# EAGLE design V9 (EAGLE 9.6.2)
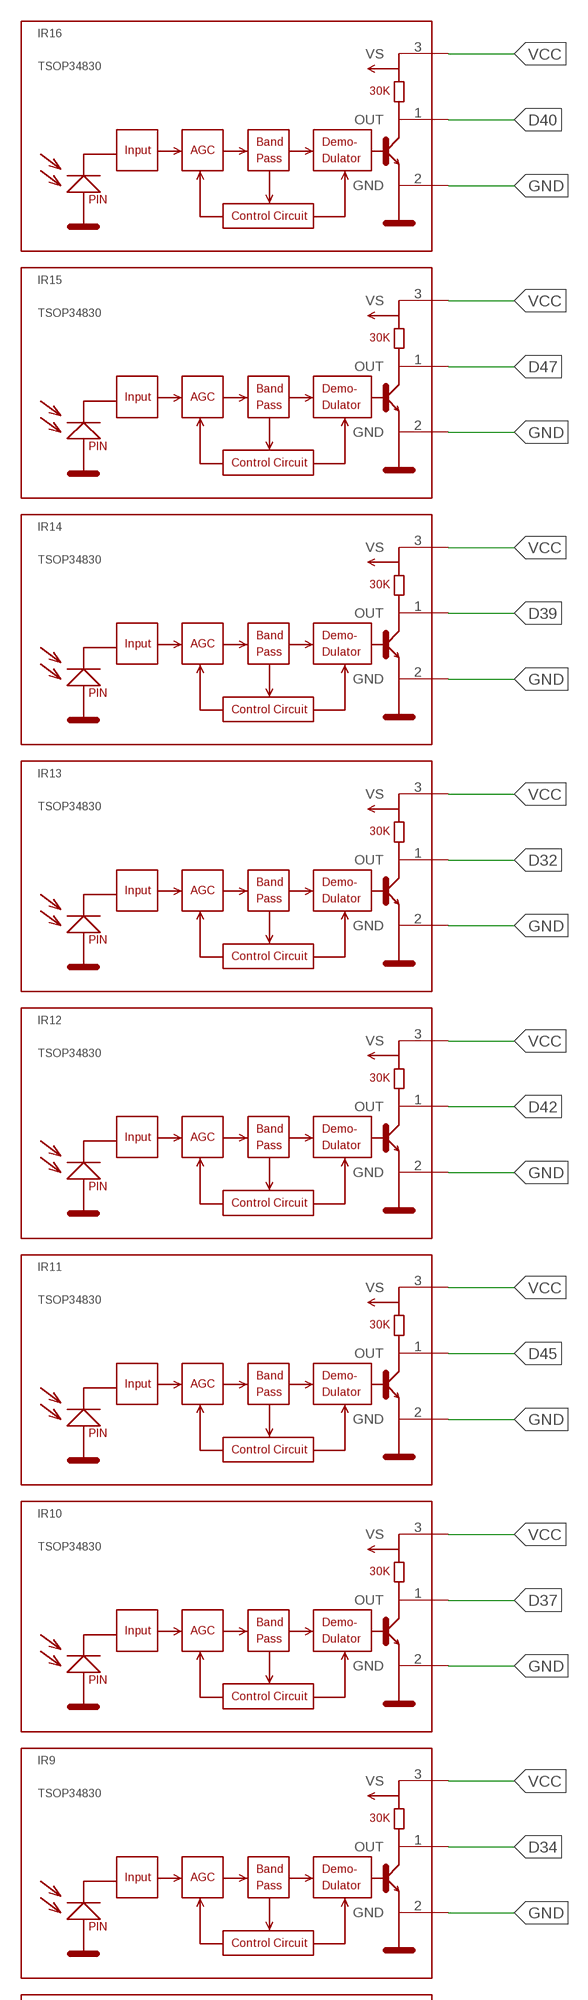
[diagram p0: schematic, sheet 1, part 1 of 2]
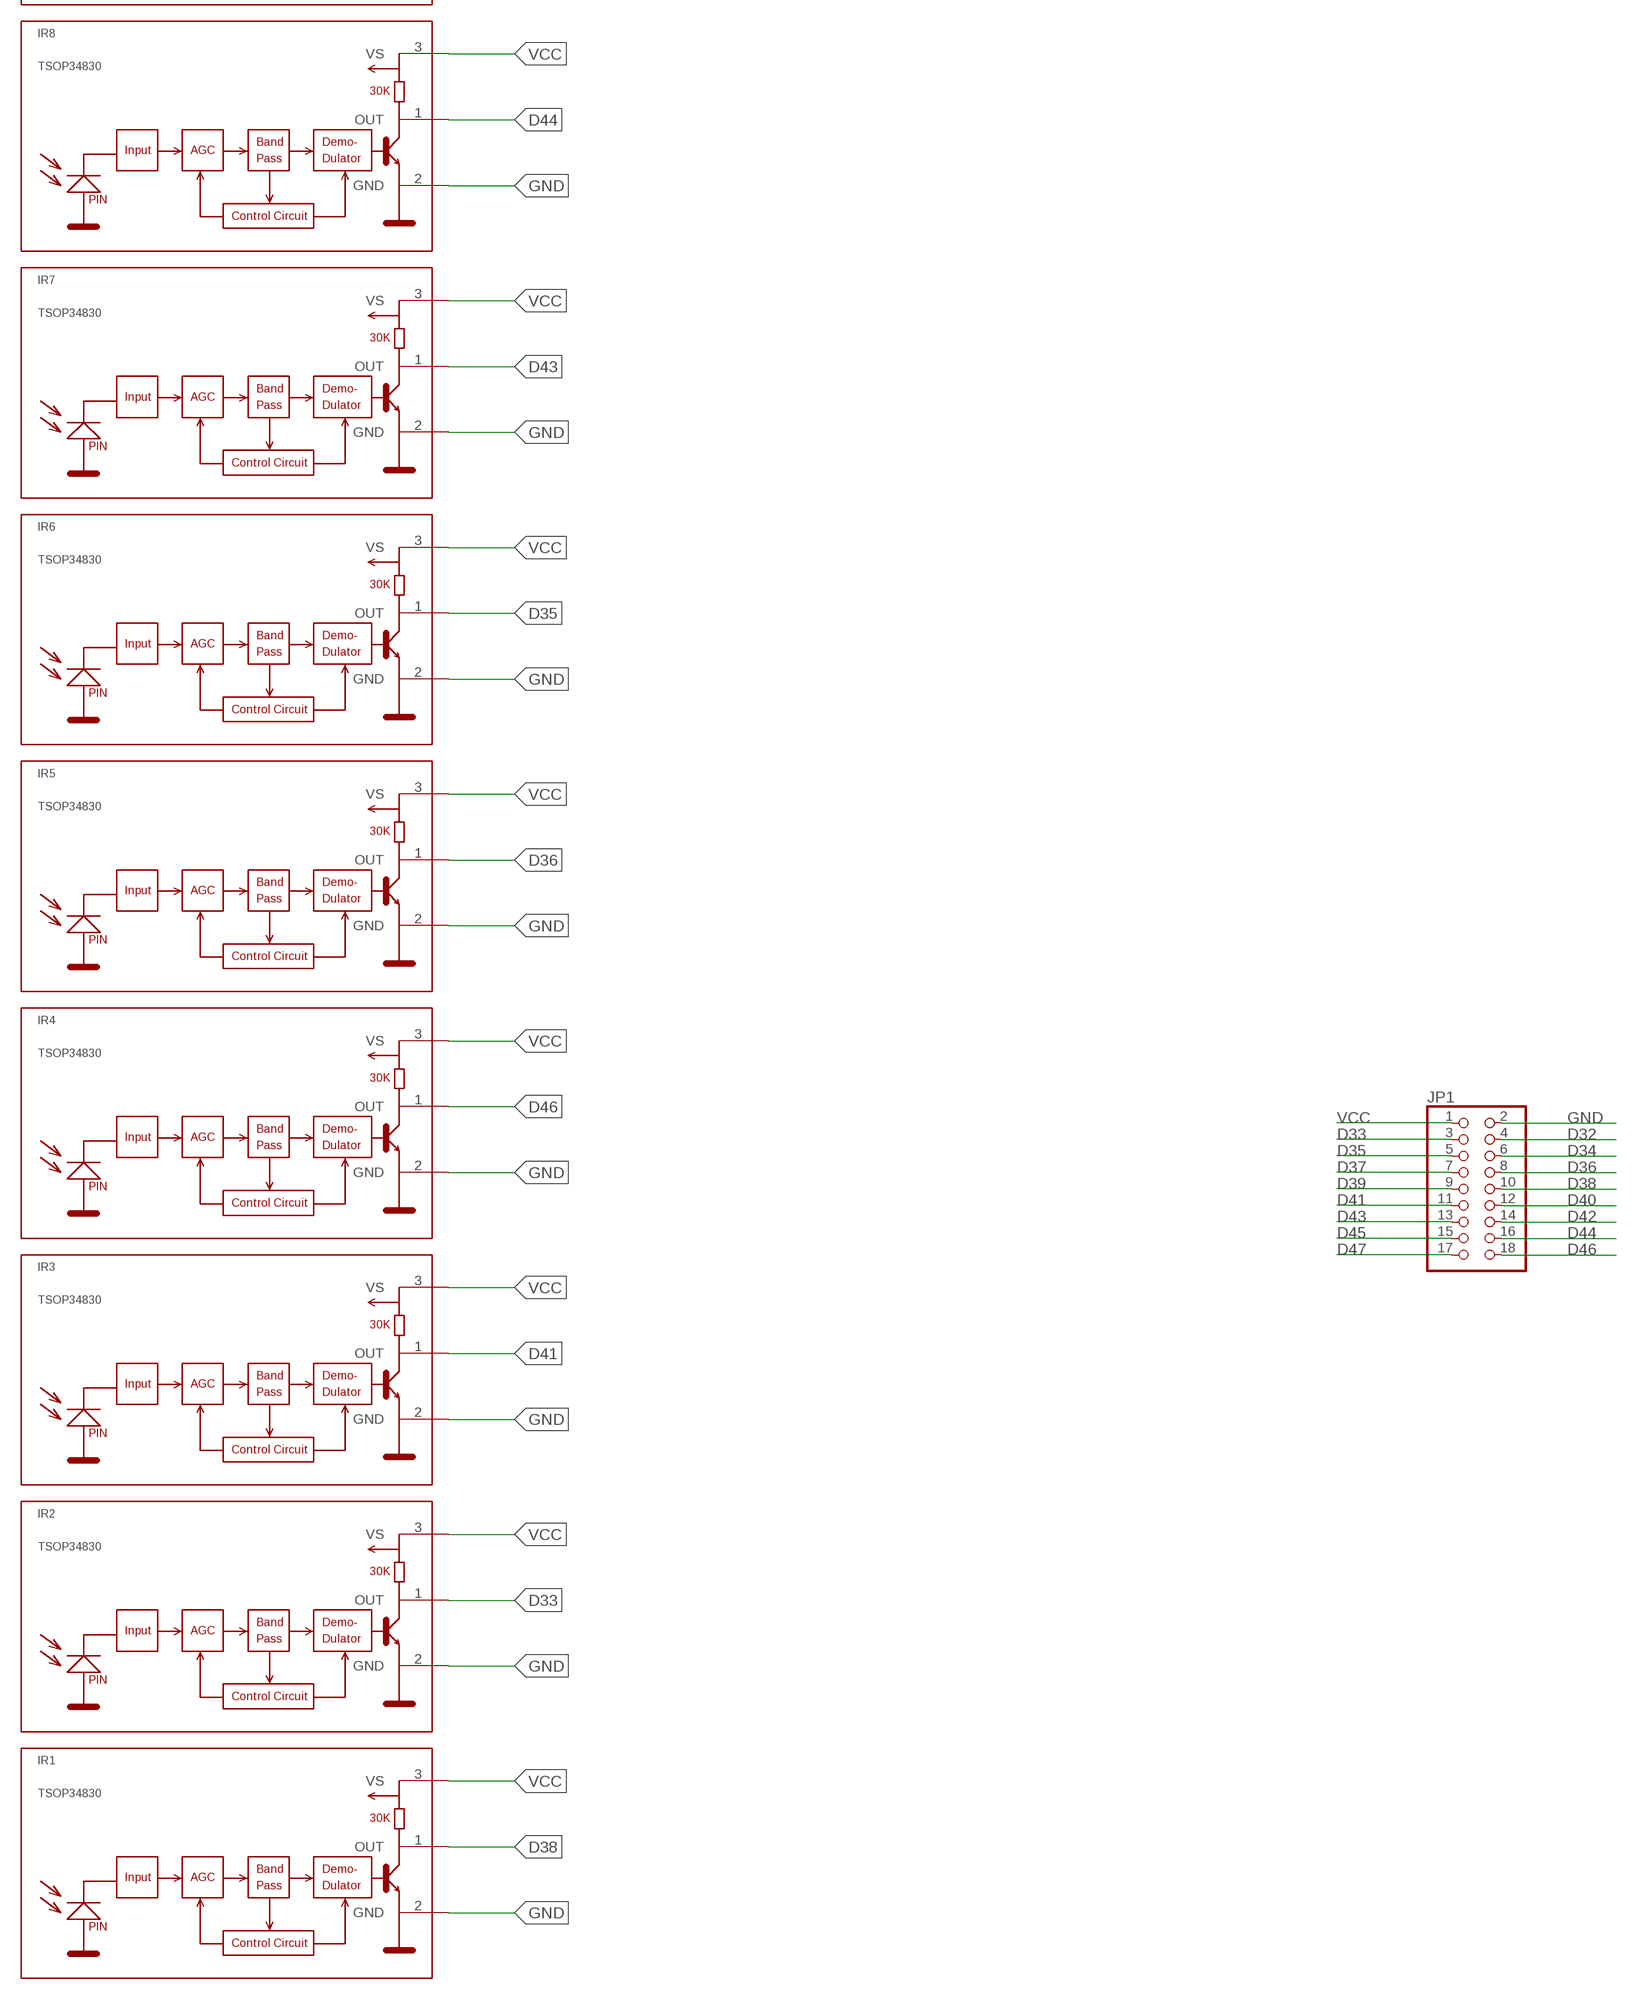
[diagram p1: schematic, sheet 1, part 2 of 2]

## Parts
IR1  TSOP34830  [TSOP348]
IR2  TSOP34830  [TSOP348]
IR3  TSOP34830  [TSOP348]
IR4  TSOP34830  [TSOP348]
IR5  TSOP34830  [TSOP348]
IR6  TSOP34830  [TSOP348]
IR7  TSOP34830  [TSOP348]
IR8  TSOP34830  [TSOP348]
IR9  TSOP34830  [TSOP348]
IR10  TSOP34830  [TSOP348]
IR11  TSOP34830  [TSOP348]
IR12  TSOP34830  [TSOP348]
IR13  TSOP34830  [TSOP348]
IR14  TSOP34830  [TSOP348]
IR15  TSOP34830  [TSOP348]
IR16  TSOP34830  [TSOP348]
JP1  PINHD-2X09_2.54  [2X09]

## Nets
D32: IR13.1(OUT) JP1.4
D33: IR2.1(OUT) JP1.3
D34: IR9.1(OUT) JP1.6
D35: IR6.1(OUT) JP1.5
D36: IR5.1(OUT) JP1.8
D37: IR10.1(OUT) JP1.7
D38: IR1.1(OUT) JP1.10
D39: IR14.1(OUT) JP1.9
D40: IR16.1(OUT) JP1.12
D41: IR3.1(OUT) JP1.11
D42: IR12.1(OUT) JP1.14
D43: IR7.1(OUT) JP1.13
D44: IR8.1(OUT) JP1.16
D45: IR11.1(OUT) JP1.15
D46: IR4.1(OUT) JP1.18
D47: IR15.1(OUT) JP1.17
GND: IR1.2(GND) IR2.2(GND) IR3.2(GND) IR4.2(GND) IR5.2(GND) IR6.2(GND) IR7.2(GND) IR8.2(GND) IR9.2(GND) IR10.2(GND) IR11.2(GND) IR12.2(GND) IR13.2(GND) IR14.2(GND) IR15.2(GND) IR16.2(GND) JP1.2
VCC: IR1.3(VS) IR2.3(VS) IR3.3(VS) IR4.3(VS) IR5.3(VS) IR6.3(VS) IR7.3(VS) IR8.3(VS) IR9.3(VS) IR10.3(VS) IR11.3(VS) IR12.3(VS) IR13.3(VS) IR14.3(VS) IR15.3(VS) IR16.3(VS) JP1.1

## Library data of the parts
IR1-IR16 = vishay-1:TSOP348*: IR Receiver Modules for Remote Control Systems http://www.vishay.com/ir-receiver-modules/
JP1 = pinhead-2:PINHD-2X09: PIN HEADER

## Net classes
0 default: clearance 1 mm

## Board
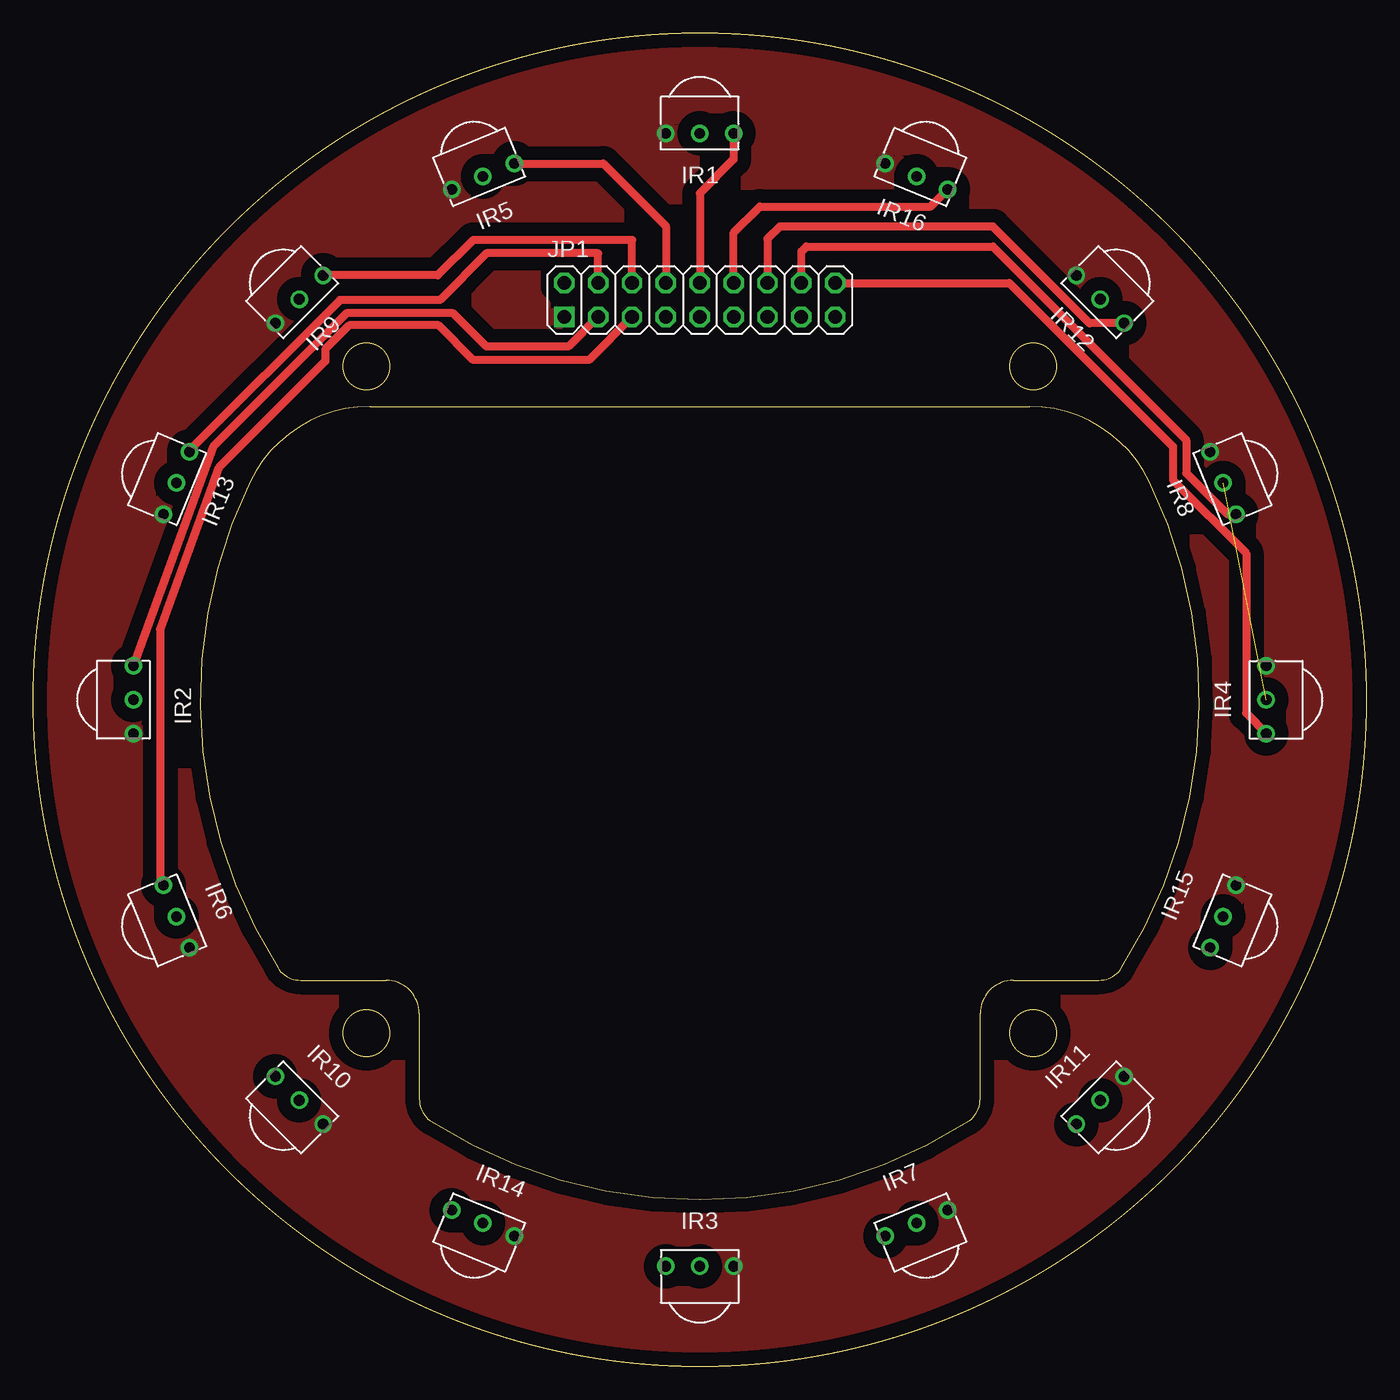
[diagram p2: board, top side]
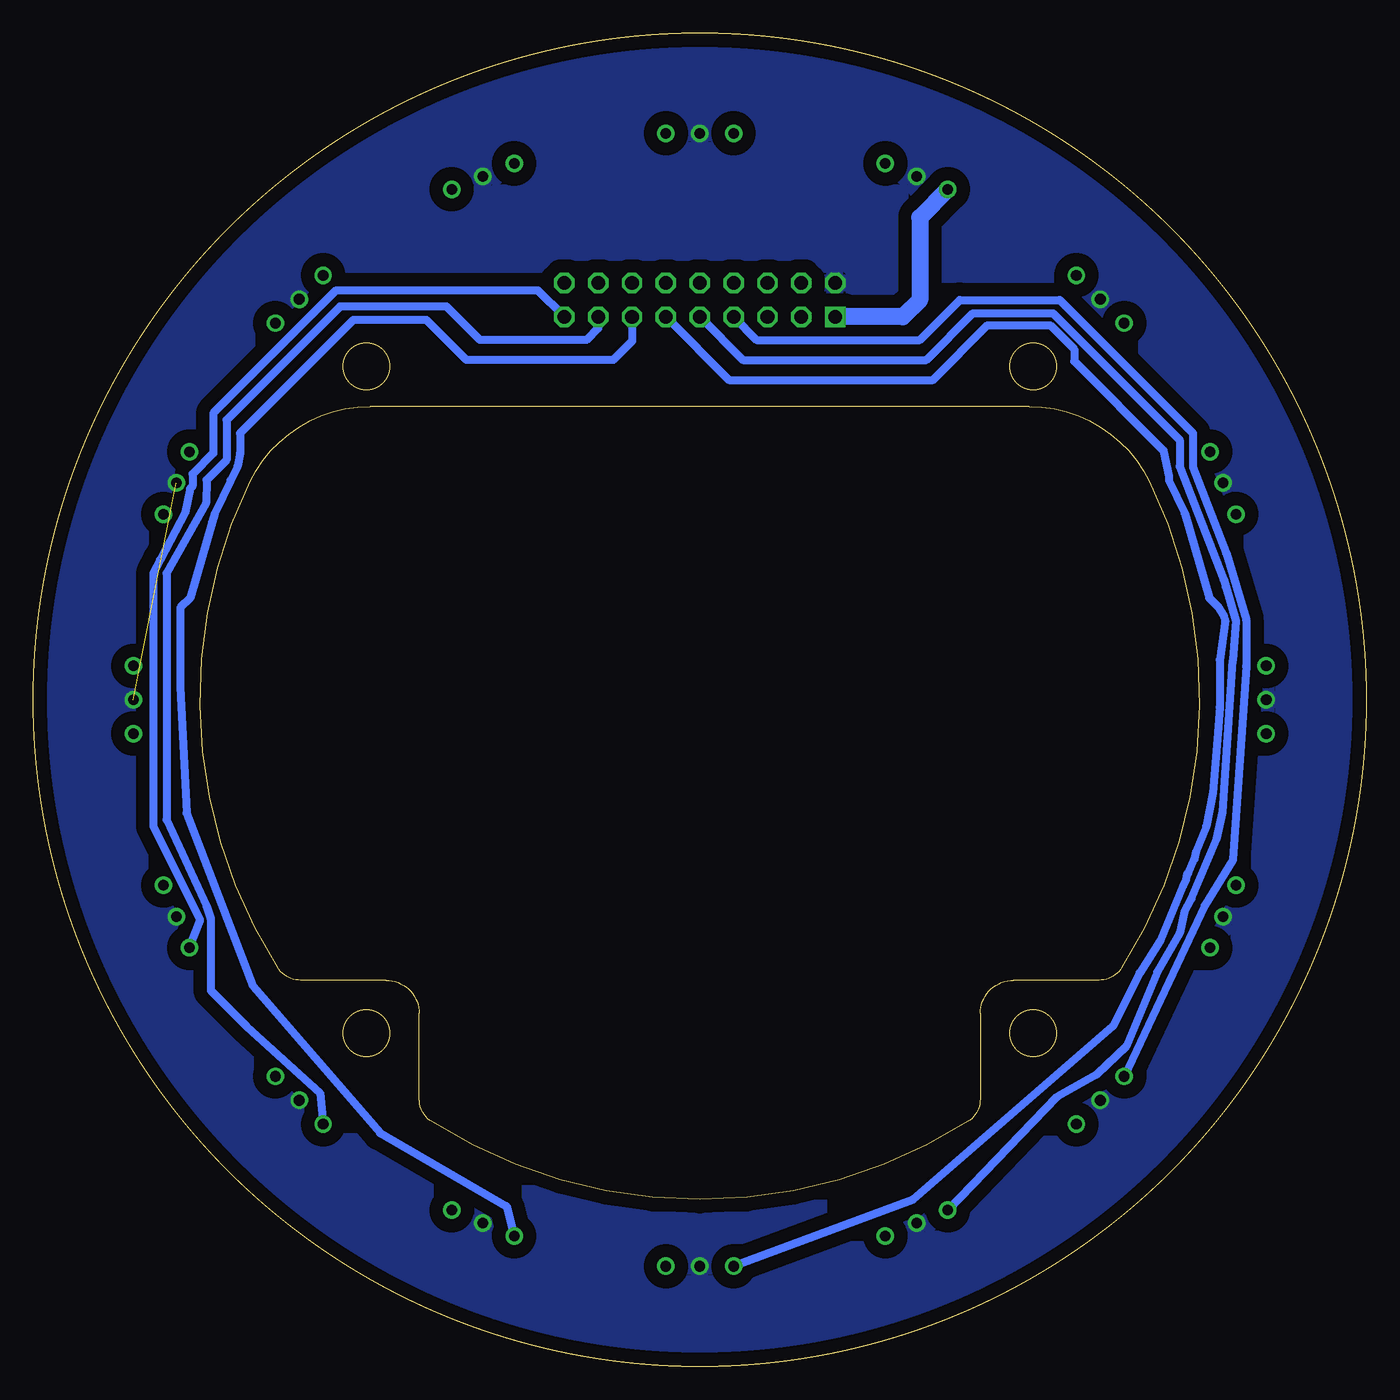
[diagram p3: board, bottom side, seen from below]

Size 100 x 100 mm. Coordinates in mm from the lower left corner, seen from the top.
Outline: 28.96,20.04 arc58 29.89,18.35 arc65 70.11,18.35 arc58 71.04,20.04 71.04,26.46 arc-90 73.54,28.96 79.96,28.96 arc58 81.65,29.89 arc58 83.74,66.36 arc64 74.74,72 25.26,72 arc64 16.26,66.36 arc58 18.35,29.89 arc58 20.04,28.96 26.46,28.96 arc-90 28.96,26.46 28.96,20.04
Outline: circle at 25,75 radius 1.75
Outline: circle at 75,25 radius 1.75
Outline: circle at 50,50 radius 50
Outline: circle at 25,25 radius 1.75
Outline: circle at 75,75 radius 1.75
Copper layers (1*16): Top 0.035mm / dielectric 1.5mm / Bottom 0.035mm
Design rules "default": minimum track width 6mil, minimum drill 0.35mm, track to track 6mil, track to pad 6mil, pad to pad 6mil, via to via 6mil, smd to smd 6mil, copper to edge 40mil, drill to drill 6mil, minimum pad ring 10mil, minimum via ring 8mil, stop-mask expansion 4mil, vias tented up to drill 0mil, thermal gap 10mil

### Footprints (pad centres in the part's own frame; a part is rotated, then mirrored left to right if it is on the bottom)
TSOP348 = drill 0.8: 1 -2.54,0; 2 0,0; 3 2.54,0
2X09 = drill 1.016 square: 1 -10.16,-1.27 | drill 1.016 octagon: 2 -10.16,1.27; 3 -7.62,-1.27; 4 -7.62,1.27; 5 -5.08,-1.27; 6 -5.08,1.27; 7 -2.54,-1.27; 8 -2.54,1.27; 9 0,-1.27; 10 0,1.27; 11 2.54,-1.27; 12 2.54,1.27; 13 5.08,-1.27; 14 5.08,1.27; 15 7.62,-1.27; 16 7.62,1.27; 17 10.16,-1.27; 18 10.16,1.27

### Placement (x,y rotation side)
IR1  50,92.5 180 top
IR2  7.5,50 270 top
IR3  50,7.5 0 top
IR4  92.5,50 90 top
IR5  33.74,89.27 202.5 top
IR6  10.73,33.74 292.5 top
IR7  66.26,10.73 22.5 top
IR8  89.27,66.26 112.5 top
IR9  19.95,80.05 225 top
IR10  19.95,19.95 315 top
IR11  80.05,19.95 45 top
IR12  80.05,80.05 135 top
IR13  10.73,66.26 247.5 top
IR14  33.74,10.73 337.5 top
IR15  89.27,33.74 67.5 top
IR16  66.26,89.27 157.5 top
JP1  50,80 0 top

### Tracks (layer width: path | path; a pad name or v marks a point on that pad's centre or on a via)
D32
  Top 0.61: JP1.4 42.38,83.5 34,83.5 30.5,80 23,80 11.71,68.71 IR13.1
D33
  Top 0.61: JP1.3 40.15,76.5 34,76.5 31.5,79 23.5,79 13.5,69 IR2.1
D34
  Top 0.61: JP1.6 44.92,84.5 33,84.5 30.35,81.85 IR9.1
D35
  Top 0.61: JP1.5 41.69,75.5 33,75.5 30.4,78.1 23.7,78.1 21.9,76.3 21.9,75.4 13.92,67.42 9.5,55.3 9.5,36.35 IR6.1
D36
  Top 0.61: IR5.1 42.76,90.24 47.46,85.54 JP1.8
D37
  Bottom 0.61: JP1.7 45.73,77 33.5,77 30.5,80 23,80 13,70 13,67.5 10.5,61 9,56 9,52.5 10,38 12.11,34.57 IR10.1
D38
  Top 0.61: IR1.1 52.54,90.54 50,88 JP1.10
D39
  Bottom 0.61: JP1.9 46.77,75.5 33,75.5 29.5,79 23.5,79 14,69.5 14,67.5 10.7,59.01 10.54,58.49 9.77,55.92 10,53 10.76,41.57 11.21,39.56 13.11,35.06 13.63,34.07 14,32.5 15.68,29.57 18,24 20.21,21.88 23.2,20.2 IR14.1
D40
  Top 0.61: JP1.12 52.54,85.04 54.5,87 67.32,87 IR16.1
D41
  Bottom 0.61: JP1.11 47.81,74 32.5,74 28.4,78.1 23.7,78.1 21.9,76.3 21.9,75.4 15.2,68.7 14.8,66.77 14.8,66.45 13.61,63.98 11.77,57.64 11.12,56.99 10.67,56.28 10.58,55.98 11,53 11,49.45 11.13,47.51 11.5,43 12,40.5 12.77,38.59 12.89,38.04 13.35,36.96 13.41,36.98 13.5,36.5 13.74,36.02 15.44,31.95 17,29.51 19,25.5 19.01,25.51 34,12.5 IR3.1
D42
  Top 0.61: IR12.1 79.24,78.26 72,85.5 56,85.5 55.08,84.58 JP1.14
D43
  Bottom 0.61: JP1.13 55.08,76.92 56.5,75.5 67.5,75.5 70.5,78.5 76,78.5 84.5,70 84.5,68.5 84.68,67.51 85.2,66.45 | 85.2,66.45 | 85.2,66.45 86.39,63.98 86.59,63.31 | 86.59,63.31 | 86.59,63.31 88.23,57.64 88.97,56.9 88.97,50.97 88.5,41.5 83.5,28.5 74,17.5 64.5,12 IR7.1
D44
  Top 0.61: JP1.16 57.62,83.62 58,84 72,84 86.5,69.5 86.5,67 89.58,63.92 IR8.1
D45
  Bottom 0.61: JP1.15 57.62,77.88 58.5,77 66.5,77 69,79.5 77,79.5 85.5,71 85.5,68 87,66.5 87.05,64.75 90,59.5 90,41 87,34.5 86.7,33.61 86.68,33.56 86.68,33.55 86.68,33.53 86.68,28.18 84,25.5 78.5,20.5 IR11.1
D46
  Top 0.61: JP1.18 73.23,81.27 85.5,69 85.5,66.5 91,61 91,49 IR4.1
D47
  Bottom 0.61: JP1.17 62.16,80.73 77.27,80.73 86.5,71.5 86.5,68.5 88.06,66.94 88.06,66.02 88.24,65.84 88.6,64.06 90.5,60.5 91,59.5 91,40.5 87.5,33.5 IR15.1
GND  (1 unrouted)
  pour Bottom: -1.5,101 -1.5,-2 102,-2 102,101
VCC
  Bottom 1.27: IR5.3 33.5,86.18 33.5,80 34.77,78.73 JP1.1
  pour Top: -1.5,101.5 -1.5,21 21.5,-2 75,-2 102,25 102,75.5 76,101.5